# EAGLE design Smart_window_v1.0 (EAGLE 9.6.2)
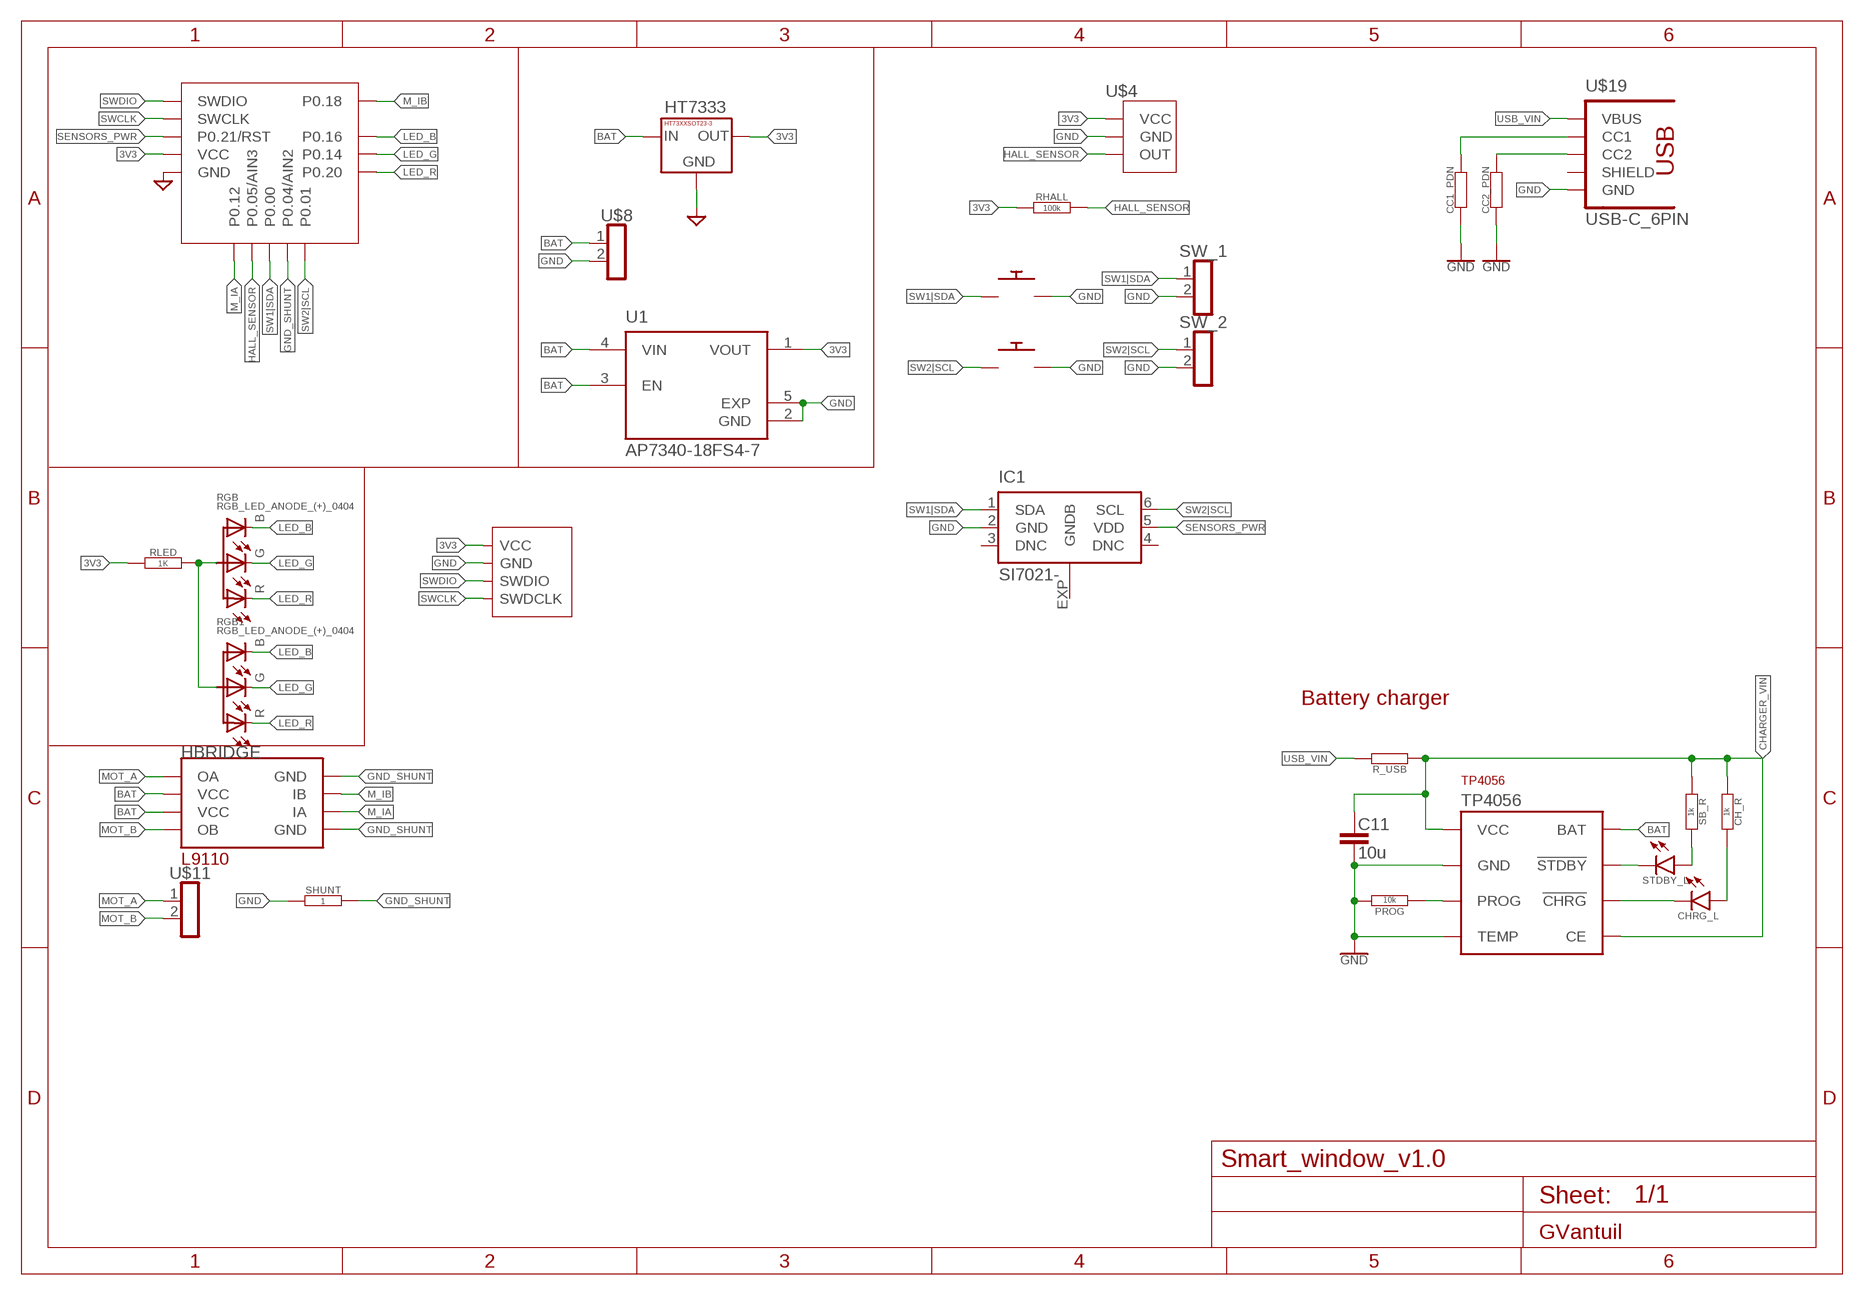
[diagram p0: schematic, sheet 1]

## Parts
C11  10u  CAP_0402-CAP  [0402-CAP]
CC1_PDN  RESISTOR0402-RES  [0402-RES]
CC2_PDN  RESISTOR0402-RES  [0402-RES]
CH_R  1k  RESISTOR0402-RES  [0402-RES]
CHRG_L  LED_0402  [0402]
HBRIDGE  L9110  [SOP8]
HT7333  HT73XXSOT23-3  [SOT23-3]
IC1  SI7021-  [DFN6-3X3]
PROG  10k  RESISTOR0402-RES  [0402-RES]
R_USB  RESISTOR0402-RES  [0402-RES]
RGB  RGB_LED_ANODE_(+)_0404  [0404]
RGB1  RGB_LED_ANODE_(+)_0404  [0404]
RHALL  100k  RESISTOR0402-RES  [0402-RES]
RLED  1K  RESISTOR0402-RES  [0402-RES]
SB_R  1k  RESISTOR0402-RES  [0402-RES]
SHUNT  1  RESISTOR0402-RES  [0402-RES]
STDBY_L  LED_0402  [0402]
SW1  PUSHBUTTON_3X3_SMALL_FOOTPRINT  [PUSHBUTTON_3X3MM_(SMALL_FOOTPRINT)]
SW2  PUSHBUTTON_3X3_SMALL_FOOTPRINT  [PUSHBUTTON_3X3MM_(SMALL_FOOTPRINT)]
SW_1  PINH1X02_2MM  [1X02_2MM]
SW_2  PINH1X02_2MM  [1X02_2MM]
TP4056  TP4056_SOP8  [SOP8]
U1  AP7340-18FS4-7  [VREG_AP7340-18FS4-7]
U$2  E104-BT5005A  [E104-BT5005A]
U$4  49E  [TO92_HALLSENSOR]
U$8  PINH1X02  [1X02]
U$9  GV_SWD_4P  [GV_SWD_1.27MM_4P_SEMI_SMD]
U$11  PINH1X02_2MM  [1X02_2MM]
U$19  USB-C_6PIN  [USCX-06FX-XXMX-01]

## Nets
3V3: HT7333.2(3.OUT) RHALL.1 RLED.1 U1.1(VOUT) U$2.VCC U$4.VCC U$9.VCC
BAT [pwr]: HBRIDGE.P$2(VCC) HBRIDGE.P$3(VCC) HT7333.3(1.IN) TP4056.P$5(BAT) U1.3(EN) U1.4(VIN) U$8.1
CHARGER_VIN [pwr]: C11.1 CH_R.1 R_USB.1 SB_R.1 TP4056.P$4(VCC) TP4056.P$8(CE)
GND [pwr]: C11.2 CC1_PDN.1 CC2_PDN.1 HT7333.1(2.GND) IC1.2(GND) PROG.2 SHUNT.1 SW1.1 SW1.2 SW2.1 SW2.2 SW_1.2 SW_2.2 TP4056.P$1(TEMP) TP4056.P$3(GND) U1.2(GND) U1.5(EXP) U$2.GND U$2.GND1(GND) U$4.GND U$8.2 U$9.GND U$19.GND1(GND) U$19.GND2(GND)
GND_SHUNT: HBRIDGE.P$5(GND) HBRIDGE.P$8(GND) SHUNT.2 U$2.P0.04(P0.04/AIN2)
HALL_SENSOR: RHALL.2 U$2.P0.05(P0.05/AIN3) U$4.OUT
LED_B: RGB1.B(LED_BLUE) RGB.B(LED_BLUE) U$2.P0.16
LED_G: RGB1.G(LED_GREEN) RGB.G(LED_GREEN) U$2.P0.14
LED_R: RGB1.R(LED_RED) RGB.R(LED_RED) U$2.P0.20
M_IA: HBRIDGE.P$6(IA) U$2.P0.12
M_IB: HBRIDGE.P$7(IB) U$2.P0.18
MOT_A [pwr]: HBRIDGE.P$1(OA) U$11.1
MOT_B [pwr]: HBRIDGE.P$4(OB) U$11.2
N$1: RGB1.COM(COMMON_ANODE) RGB.COM(COMMON_ANODE) RLED.2
N$2: CHRG_L.C TP4056.P$7(!CHRG)
N$4: CC2_PDN.2 U$19.CC2
N$7: STDBY_L.C TP4056.P$6(!STDBY)
N$9: CC1_PDN.2 U$19.CC1
N$14: PROG.1 TP4056.P$2(PROG)
N$16: SB_R.2 STDBY_L.A
N$17: CH_R.2 CHRG_L.A
SENSORS_PWR: IC1.5(VDD) U$2.P0.21/RST
SW1|SDA: IC1.1(SDA) SW1.3 SW1.4 SW_1.1 U$2.P0.00
SW2|SCL: IC1.6(SCL) SW2.3 SW2.4 SW_2.1 U$2.P0.01
SWCLK: U$2.SWCLK U$9.SWDCLK
SWDIO: U$2.SWDIO U$9.SWDIO
USB_VIN [pwr]: R_USB.2 U$19.VBUS1(VBUS) U$19.VBUS2(VBUS)
Unconnected: IC1.3(DNC) IC1.4(DNC) IC1.EXP(GNDB)

## Notes on the sheet
- Battery charger

## Power pins joined to a net without a drawn wire
SHIELD: U$19.SHIELD1(SHIELD) U$19.SHIELD2(SHIELD) U$19.SHIELD3(SHIELD) U$19.SHIELD4(SHIELD)

## Library data of the parts
C11 = 0000_GV_capacitors:CAP_: Capacitor Standard 0603 ceramic capacitor, and 0.1" leaded capacitor.
CC1_PDN CC2_PDN CH_R PROG R_USB RHALL RLED SB_R SHUNT = 0000_GV_resistors:RESISTOR: Resistor Basic schematic elements and footprints for 0603, 1206, and PTH 1/10th watt (small) resistors.
CHRG_L STDBY_L = 0000_GV_Leds:LED
HBRIDGE = 0000_GV_h_bridge:L9110
HT7333 = 0000_GV_regulators:HT73XX
IC1 = 0000_GV_sensors:SI7021-*: I2C Humidity and Temperature Sensor Source: http://www.silabs.com/Support%20Documents/TechnicalDocs/Si7021.pdf
RGB RGB1 = 0000_GV_Leds:RGB_LED_ANODE_(+)
SW1 SW2 = 0000_GV_switches:PUSHBUTTON
SW_1 SW_2 U$8 U$11 = 0000_GV_connectors:PINH1X02
TP4056 = 0000_GV_batteries:TP4056: TP4056 Data sheet <http://goo.gl/J7k8TF> Dave.Calaway Eagle Library <https://goo.gl/Muy1Tr>
U1 = 0000_GV_regulators:AP7340-18FS4-7: Linear Voltage Regulator IC 1 Output 150mA X2-DFN1010-4 Check availability <https://pricing.snapeda.com/parts/AP7340-18FS4-7/Diodes%20Inc./view-part?ref=eda>; AVAILABILITY: In Stock; CHECK_PRICES: https://www.snapeda.com/parts/AP7340-18FS4-7/Diodes+Inc./view-part/?ref=eda; DESCRIPTION: Linear Voltage Regulator IC Positive Fixed 1 Output 150mA X2-DFN1010-4; MF: Diodes Inc.; MP: AP7340-18FS4-7; PACKAGE: XDFN-4 Diodes Incorporated; PRICE: None; SNAPEDA_LINK: https://www.snapeda.com/parts/AP7340-18FS4-7/Diodes+Inc./view-part/?ref=snap
U$2 = 0000_GV_MCUs:E104-BT5005A
U$4 = 0000_GV_sensors:49E
U$9 = 0000_GV_connectors:GV_SWD_4P
U$19 = 0000_GV_connectors:USB-C: AliExpress Special! Connect 5.1k 10% resistors to each CC pin, pulled up to 3.3v or 5.0v.

## Net classes
0 default: width 0.127 mm, drill 0.254 mm
1 pwr: width 0.254 mm, drill 0.406 mm

## Board
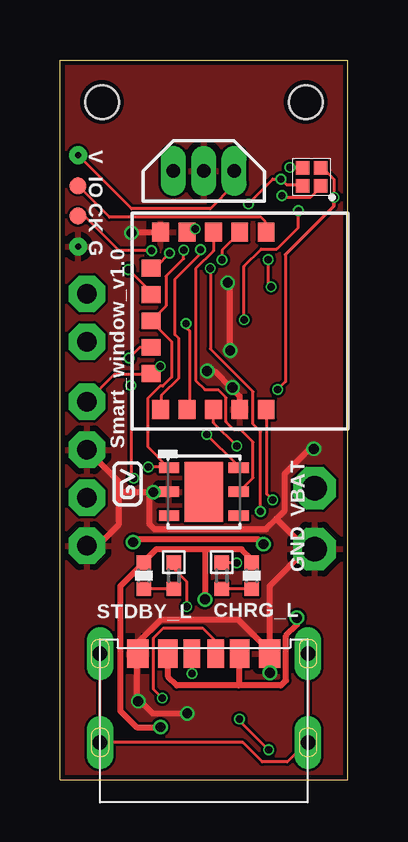
[diagram p1: board, top side]
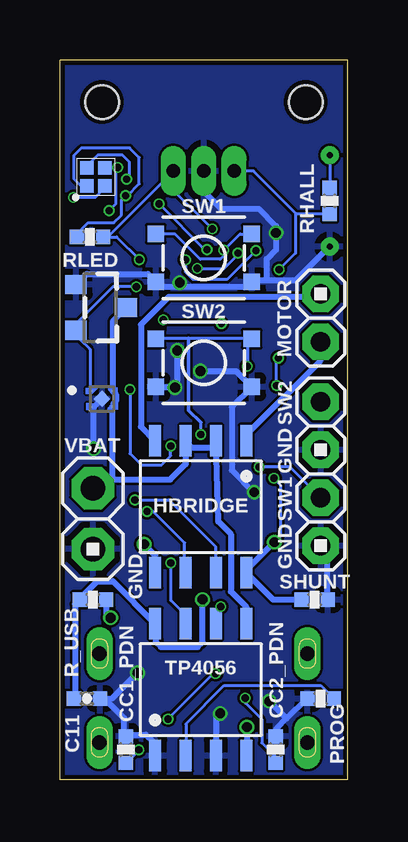
[diagram p2: board, bottom side, seen from below]

Size 12 x 30 mm. Coordinates in mm from the lower left corner, seen from the top.
Outline: 12,0 12,30 0,30 0,0 12,0
Copper layers (1*16): Top 0.035mm / dielectric 1.5mm / Bottom 0.035mm
Design rules "#jlcpcb-2layers *": minimum track width 4mil, minimum drill 0.3mm, track to track 4mil, track to pad 0.1mm, pad to pad 0.15mm, via to via 4mil, smd to smd 0mil, copper to edge 0.2mm, drill to drill 0.2mm, minimum pad ring 0.25mm, minimum via ring 0.075mm, stop-mask expansion 2mil, vias tented up to drill 100mil, thermal gap 10mil
tKeepout: area 9.3,14.2 to 12.5,24

### Footprints (pad centres in the part's own frame; a part is rotated, then mirrored left to right if it is on the bottom)
0402-CAP = smd 0.6 x 0.6: 1 -0.55,0; 2 0.55,0
0402-RES = smd 0.6 x 0.6: 1 -0.55,0; 2 0.55,0
0402 = smd 0.6 x 0.6: A -0.55,0; C 0.55,0
SOP8 = smd 1.3 x 0.5: P$1 -2.75,1.905; P$2 -2.75,0.635; P$3 -2.75,-0.635; P$4 -2.75,-1.905; P$5 2.75,-1.905; P$6 2.75,-0.635; P$7 2.75,0.635; P$8 2.75,1.905
SOT23-3 = smd 0.8 x 0.9: 1 -0.95,-1; 2 0.95,-1; 3 0,1.1
DFN6-3X3 = smd 0.85 x 0.45: 1 -1.45,1; 2 -1.45,0; 3 -1.45,-1; 4 1.45,-1; 5 1.45,0; 6 1.45,1 | smd 1.6 x 2.5: EXP 0,0
0404 = smd 0.55 x 0.55: B -0.375,-0.375; COM -0.375,0.375; G 0.375,-0.375; R 0.375,0.375
PUSHBUTTON_3X3MM_(SMALL_FOOTPRINT) = smd 0.7 x 0.7: 1 -2,1; 2 2,1; 3 -2,-1; 4 2,-1
1X02_2MM = drill 0.813 pad 1.524 octagon: 1 -1,0; 2 1,0
VREG_AP7340-18FS4-7 = smd 0.1 x 0.1: 1 -0.45,0.325; 2 -0.45,-0.325; 3 0.45,-0.325; 4 0.45,0.325 | smd 0.48 x 0.48 rotated 45: 5 0,0
E104-BT5005A = smd 0.8 x 0.7: GND -3.7,-3.3; GND1 3.7,0; P0.14 3.7,-2.2; P0.16 3.7,-1.1; P0.18 3.7,1.1; P0.20 3.7,-3.3; P0.21/RST -3.7,-1.1; SWCLK -3.7,0; SWDIO -3.7,1.1; VCC -3.7,-2.2 | smd 0.7 x 0.8: P0.00 0,-3.7; P0.01 2.2,-3.7; P0.04 1.1,-3.7; P0.05 -1.1,-3.7; P0.12 -2.2,-3.7
M1.4_SCREW = hole 1.4: 0,0
TO92_HALLSENSOR = drill 0.55 pad 1.016 long: GND 0,0; OUT -1.27,0; VCC 1.27,0
1X02 = drill 1.016 pad 1.778 octagon: 1 -1.27,0; 2 1.27,0
GV_SWD_1.27MM_4P_SEMI_SMD = drill 0.25 pad 0.7: GND 1.905,0; VCC -1.905,0 | smd 0.7 x 0.7: SWDCLK 0.635,0; SWDIO -0.635,0
USCX-06FX-XXMX-01 = smd 0.7 x 1.2: CC1 0.5,-1.75; CC2 -0.5,-1.75 | smd 0.9 x 1.2: GND1 2.75,-1.75; GND2 -2.75,-1.75 | drill 0.6 long: SHIELD1 4.325,1.95; SHIELD2 4.325,-1.75; SHIELD3 -4.35,-1.75; SHIELD4 -4.35,1.95 | smd 0.8 x 1.2: VBUS1 1.5,-1.75; VBUS2 -1.5,-1.75

### Placement (x,y rotation side)
C11  10.88,3.38 0 bottom
CC1_PDN  9.25,1.25 270 bottom
CC2_PDN  3,1.25 270 bottom
CH_R  8,8.5 270 top
CHRG_L  6.75,8.5 90 top
HBRIDGE  6.12,11.38 270 bottom
HT7333  10.33,19.68 270 bottom
IC1  6,12 0 top
PROG  1.12,3.38 180 bottom
R_USB  10.62,7.5 0 bottom
RGB  10.5,25.12 90 bottom
RGB1  10.5,25.12 180 top
RHALL  0.75,24.12 270 bottom
RLED  10.75,22.62 180 bottom
SB_R  3.5,8.5 270 top
SHUNT  1.38,7.5 180 bottom
STDBY_L  4.75,8.5 90 top
SW1  6,21.75 180 bottom
SW2  6,17.38 180 bottom
SW_1  1.12,10.75 270 bottom
SW_2  1.12,14.75 270 bottom
TP4056  6.12,3.75 90 bottom
U1  10.25,15.88 0 bottom
U$2  7.5,19.12 270 top
U$3  [M1.4_SCREW]  10.25,28.25 0 top
U$4  6,25.38 0 top
U$5  [M1.4_SCREW]  1.75,28.25 0 top
U$8  10.62,10.88 270 bottom
U$9  0.75,24.12 270 top
U$10  [GV_2MM]  3.51,11.33 90 top
U$11  1.12,19.25 90 bottom
U$19  6,3.5 180 top

### Tracks (layer width: path | path; a pad name or v marks a point on that pad's centre or on a via)
3V3  (via drill 0.3)
  Top 0.127: U$2.VCC 5.51,22.82 v5.64,22.96 | v8.81,20.54 8.69,20.67 v8.69,21.68 | U$9.VCC 2.98,23.8 6.27,23.8 7.27,24.8 U$4.VCC
  Bottom 0.127: RHALL.1 0.74,26 U$9.VCC | U1.1 10.74,16.23 10.74,17.95 11.15,18.35 HT7333.2 11.33,19 9.79,20.54 v8.81,20.54 | v5.64,22.96 5.66,22.96 7.26,24.55 7.26,25.38 | 7.26,25.38 U$4.VCC | v8.69,21.68 9.63,22.62 RLED.1 10.01,22.62 7.26,25.38
BAT
  Bottom 0.254: 9.77,15.54 9.77,15.66 9.66,15.77 9.66,16.06 9.77,16.17 U1.4 9.8,19.11 HT7333.3 | 9.77,15.54 U1.3 | 9.77,15.54 9.83,15.43 9.83,12.54 9.8,12.51 | TP4056.P$5 4.23,6.51 4.23,7.2 4.87,7.84 4.87,10.24 5.39,10.76 HBRIDGE.P$2 5.6,13.95 5.71,13.83 6.5,13.83 6.76,14.09 HBRIDGE.P$3 6.76,13.15 7.4,12.51 9.8,12.51 | 9.8,12.51 10.24,12.51 10.6,12.14 U$8.1
CHARGER_VIN  (via drill 0.41)
  Top 0.254: 6.05,9.6 7.58,9.6 8,9.18 CH_R.1 | 6.05,9.6 4.01,9.6 3.5,9.09 SB_R.1 3.43,8.97 2.52,8.06 2.52,2.86 3.19,2.18 v4.2,2.18 | 6.05,9.6 v6.05,7.51
  Bottom 0.254: C11.1 11.37,3.43 11.37,7.32 11.2,7.49 R_USB.1 11.18,7.54 10.45,8.26 9.79,8.26 TP4056.P$8 8.01,6.47 8.01,5.74 7.79,5.52 6.25,5.52 6.05,5.72 v6.05,7.51 | v4.2,2.18 4.2,1.01 TP4056.P$4
GND  (via drill 0.41, 0.41 pad 0.5)
  Top 0.254: U$2.GND 4.17,22.8 v2.98,22.8 | U$2.GND1 7.5,15.98 7.17,16.31 | 7.17,16.31 6.45,17.03 v6.14,17.03 | 7.17,16.31 v7.2,16.34 | v7,20.71 7.08,20.63 7.08,17.91 v7.11,17.89 | U$19.GND2 8.74,5.37 7.46,6.66 4.2,6.66 3.26,5.71 U$19.GND1 3.2,5.14 3.2,3.43 | v5.32,2.76 3.87,2.76 3.2,3.43 | 3.2,3.43 3.2,3.26 v3.26,3.26 | IC1.2 4.51,12 4.32,12 4.29,11.98 v3.9,11.98 | v10.59,13.79 10.41,13.79 9.38,12.76 9.38,11.23 9.02,10.87 | v3.9,11.98 3.72,11.8 3.72,10.66 3.94,10.44 8.6,10.44 9.02,10.87 | v3.9,11.98 2.44,11.98 | 2.44,11.98 2.44,12.44 SW_2.2 | 2.44,11.98 2.44,10.61 1.58,9.75 SW_1.2 | U$19.GND2 8.75,4.46 v8.76,4.45 | 9.02,10.87 10.28,9.61 | 10.28,9.61 U$8.2 | U$19.GND2 8.75,8.07 10.28,9.61
  Bottom 0.254: U$4.GND 6,24.51 5.29,23.8 3.7,23.8 2.98,23.08 v2.98,22.8 2.98,22.09 3.37,21.7 3.37,20.8 | v6.14,17.03 4.66,17.03 SW2.1 4.83,15.55 4.83,12.91 v3.9,11.98 | SW2.2 7.94,16.34 v7.2,16.34 7.11,16.44 v7.11,17.89 | HT7333.1 10.88,21.08 8.33,21.08 SW1.2 7.8,20.55 7,20.55 | 3.37,20.8 2.17,20.8 0.8,22.17 U$9.GND | 3.37,20.8 3.94,20.8 SW1.1 4.2,20.55 7,20.55 | 2.54,2.54 1.71,3.37 PROG.2 | 2.54,2.54 2.97,2.12 2.97,1.83 CC2_PDN.1 | v5.32,2.76 5.49,2.58 5.49,1.03 TP4056.P$3 | v3.26,3.26 2.54,2.54 | SHUNT.1 0.86,7.54 0.86,9.49 SW_1.2 | TP4056.P$1 8.06,1.03 8.06,1.52 8.41,1.87 9.18,1.87 CC1_PDN.1 9.31,1.89 9.31,2.55 10.14,3.38 C11.2 9.84,3.38 v8.76,4.45 | 10.59,15.54 10.57,15.54 10.29,15.83 U1.5 | 10.59,15.54 10.69,15.54 U1.2 | v10.59,13.79 10.59,15.54 | v7,20.71 7,20.55
  pour Bottom: -0.41,32.55 12.84,32.55 12.84,-0.63 -0.41,-0.63
  pour Top: -0.64,-0.61 -0.64,33.66 12.48,33.66 12.48,-0.61
GND_SHUNT  (via drill 0.3, 0.41)
  Top 0.127: v3.07,12.56 2.96,12.68 v2.96,16.42 | v2.88,17.57 3.34,18.02 U$2.P0.04
  Top 0.254: v3.05,9.89 3.17,10.01 8.29,10.01 v8.49,9.81
  Bottom 0.127: v2.96,16.42 2.98,16.45 2.98,17.47 v2.88,17.57 | v3.07,12.56 2.79,12.28 2.79,10.15 v3.05,9.89 3.07,9.89 | HBRIDGE.P$8
  Bottom 0.254: SHUNT.2 3.1,7.5 HBRIDGE.P$8 4.22,8.75 3.07,9.89 | HBRIDGE.P$5 8.03,9.35 v8.49,9.81
HALL_SENSOR  (via drill 0.3)
  Top 0.127: v2.86,21.26 3.77,20.34 3.77,20.23 U$2.P0.05
  Bottom 0.127: 2.15,23.6 2.17,23.6 2.17,21.95 v2.86,21.26 | 2.15,23.6 0.8,23.6 RHALL.2 | 2.15,23.6 3.92,25.37 U$4.OUT
LED_B  (via drill 0.3)
  Top 0.127: v11.44,24.27 11.44,25.02 10.92,25.55 RGB1.B | v7.38,13.9 6.41,14.87 U$2.P0.16 | 9.41,21.88 9.41,16.59 v9.08,16.26
  Top 0.15: v11.44,24.27 11.44,23.9 9.41,21.88
  Bottom 0.127: v11.44,24.27 11.42,24.29 10.52,24.29 10.17,24.63 10.17,24.75 RGB.B | v7.38,13.9 7.38,13.49 7.77,13.11 8.6,13.11 9.08,13.59 v9.08,16.26
LED_G  (via drill 0.3)
  Top 0.127: v9.6,25.52 10.12,25.52 RGB1.G | v7.68,19.16 7.68,21.4 8.4,22.12 9.04,22.12 9.94,23.02 v9.94,23.72 | v5.26,19.01 5.26,18.85 5.4,18.72 5.4,15.52 U$2.P0.14
  Bottom 0.127: RGB1.G 10.12,25.52 v9.6,25.52 9.66,25.49 9.66,24 v9.94,23.72 | v7.68,19.16 7.59,19.07 5.33,19.07 v5.26,19.01
LED_R  (via drill 0.3)
  Top 0.127: RGB1.R 10.12,24.8 9.45,24.8 v9.22,25.03 8.88,25.03 7.87,24.02 v7.87,24 | v5.86,22.1 5.86,21.92 4.8,20.86 4.8,18.55 4.96,18.39 4.96,16.73 4.23,16 4.23,15.43 U$2.P0.20
  Bottom 0.127: v9.22,25.03 9.12,25.13 9.12,25.76 9.4,26.05 10.41,26.05 10.92,25.55 RGB.R | v7.87,24 5.96,22.1 v5.86,22.1
M_IA  (via drill 0.3)
  Top 0.127: v4.57,21.95 4,21.37 3.83,21.37 U$2.P0.12 | v6.27,21.31 6.27,17.96 8.06,16.17 8.06,14.81 8.37,14.5 v8.37,11.18
  Bottom 0.127: v4.57,21.95 4.57,21.89 5.16,21.31 v6.27,21.31 | v8.37,11.18 8.11,11.18 6.8,9.87 6.8,8.63 HBRIDGE.P$6
M_IB  (via drill 0.3)
  Top 0.127: v8.87,11.66 8.63,11.9 8.63,15.37 U$2.P0.18
  Bottom 0.127: v8.87,11.66 7.45,11.66 5.49,9.7 HBRIDGE.P$7
MOT_A
  Bottom 0.254: HBRIDGE.P$1 4.17,14.17 4.17,14.43 1.14,17.46 1.14,18.23 U$11.1
MOT_B
  Bottom 0.254: HBRIDGE.P$4 8.62,14.71 8.62,18.97 7.47,20.12 1.26,20.12 U$11.2
N$1  (via drill 0.3)
  Top 0.127: RGB.COM 10.88,24.7 10.46,24.29 9.31,24.29 v9.26,24.35
  Bottom 0.127: RGB.COM 11.12,24.75 11.42,25.04 11.42,26.02 11.11,26.33 9.09,26.33 8.69,25.93 8.69,24.84 9.18,24.35 v9.26,24.35 9.43,24.17 9.43,23.54 9.75,23.22 10.83,23.22 11.3,22.74 RLED.2
N$2  (via drill 0.3)
  Top 0.127: v7.37,9.03 6.8,9.03 CHRG_L.C
  Bottom 0.127: TP4056.P$7 6.76,6.86 7.37,7.47 v7.37,9.03
N$4  (via drill 0.3)
  Top 0.127: v4.27,3.4 3.89,3.78 3.89,5.89 4.29,6.29 5.97,6.29 6.51,5.75 6.51,5.26 U$19.CC2
  Bottom 0.127: v4.27,3.4 4.27,3.19 3.58,2.51 3.58,1.52 3.03,0.97 3.03,0.74 CC2_PDN.2
N$7  (via drill 0.3)
  Top 0.127: v5.29,7.21 5.29,8.26 4.8,8.74 4.8,9.03 STDBY_L.C
  Bottom 0.127: TP4056.P$6 5.49,7 v5.29,7.21
N$9  (via drill 0.3)
  Top 0.127: v7.49,2.52 7.49,2.46 v8.71,1.24 | U$19.CC1 v5.5,4.42
  Bottom 0.127: v8.71,1.24 8.71,1.21 8.99,0.93 CC1_PDN.2 | v7.49,2.52 5.59,4.42 v5.5,4.42
N$14
  Bottom 0.127: PROG.1 1.12,3.92 5.15,3.92 6.75,2.32 6.75,1.01 TP4056.P$2
N$16
  Top 0.127: SB_R.2 3.54,7.94 STDBY_L.A
N$17
  Top 0.127: CHRG_L.A 6.8,7.94 7.94,7.94 CH_R.2
SENSORS_PWR
  Top 0.127: IC1.5 7.49,12 8.06,12.57 8.06,14.06 7.55,14.57 7.27,14.57 6.93,14.91 6.93,15.93 6.6,16.26 6.04,16.26 5.66,16.64 5.66,21.3 6.4,22.04 U$2.P0.21/RST
SHIELD
  Top 0.127: U$19.SHIELD2 1.66,5.2 1.66,1.6 U$19.SHIELD1 1.71,1.54 7.63,1.54 8.44,0.74 9.48,0.74 10.29,1.54 U$19.SHIELD4 10.34,1.6 10.34,5.2 U$19.SHIELD3
SW1|SDA  (via drill 0.3)
  Top 0.127: v5.16,22.07 5.16,21.72 4.43,20.98 4.43,19.74 3.83,19.14 U$2.P0.00 3.83,19.09 4.66,18.26 4.66,16.78 4.29,16.4 4.17,16.4 3.66,15.89 3.66,13.88 4.54,13 IC1.1 4.46,13.03 v3.69,13.03
  Bottom 0.127: SW1.3 4.49,22.75 v5.16,22.07 5.16,21.84 5.31,21.69 6.15,21.69 7.21,22.75 SW1.4 | SW_1.1 2.4,13.03 v3.69,13.03
SW2|SCL  (via drill 0.3)
  Top 0.127: v6.12,14.39 7.32,13.19 IC1.6 | v4.18,17.23 3.88,16.93 U$2.P0.01 3.77,16.92 2.29,16.92 SW_2.1
  Bottom 0.127: 4.18,18.4 6.63,18.4 7.94,18.4 SW2.4 | 4.18,18.4 4.03,18.4 SW2.3 | v6.12,14.39 6.12,14.88 | 4.18,18.4 v4.18,17.23
  Bottom 0.15: 6.63,18.4 6.63,18.09 6.63,15.39 6.12,14.88
SWCLK  (via drill 0.3)
  Top 0.127: v3.82,22.05 2.48,22.05 1.04,23.49 0.8,23.49 U$9.SWDCLK | U$2.SWCLK 6.76,22.07 v6.76,21.67
  Bottom 0.127: v3.82,22.05 5.02,20.86 6.46,20.86 6.76,21.16 v6.76,21.67
SWDIO
  Top 0.127: U$9.SWDIO 2.06,23.44 8.39,23.44 8.57,23.26 8.57,22.86 U$2.SWDIO
USB_VIN  (via drill 0.41)
  Top 0.254: v9.89,6.74 9.89,6.46 9.43,6 9.43,4.13 9.21,3.92 7.47,3.92 | U$19.VBUS1 4.51,5.2 4.51,4.28 4.88,3.92 7.47,3.92 | U$19.VBUS2 7.47,5.22 7.47,3.92
  Bottom 0.254: v9.89,6.74 10.06,6.92 10.06,7.49 R_USB.2

### Text on the board
tNames: VBAT | GND
bNames: MOTOR | SW2 | GND | VBAT | SW1 | GND | GND